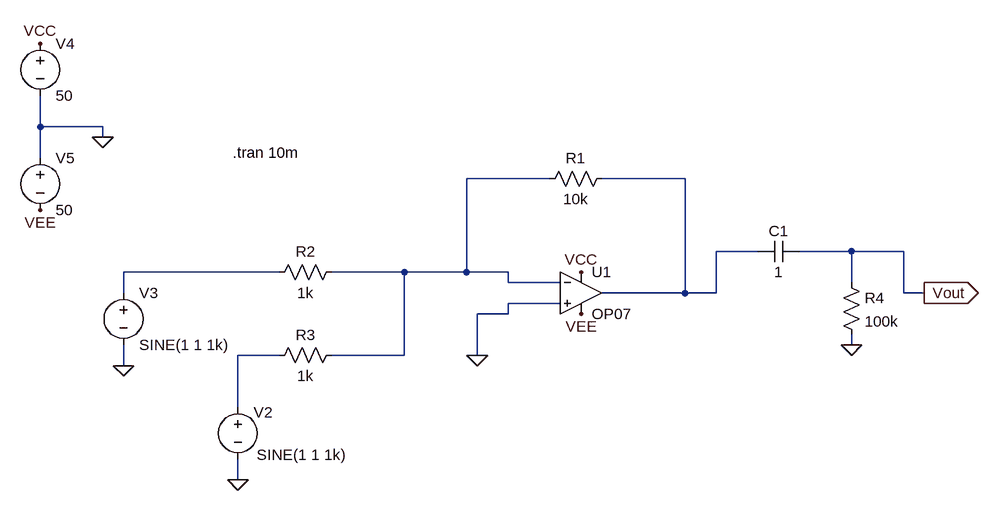
[diagram p0: schematic IdealOPamp_adder.asc]
IdealOPamp_adder.asc, the LTspice schematic file:
Version 4
SHEET 1 1188 680
WIRE -496 -224 -496 -272
WIRE -400 -224 -496 -224
WIRE -400 -208 -400 -224
WIRE -496 -176 -496 -224
WIRE 288 -144 160 -144
WIRE 496 -144 368 -144
WIRE 608 -32 544 -32
WIRE 752 -32 672 -32
WIRE 832 -32 752 -32
WIRE -128 0 -368 0
WIRE 64 0 -48 0
WIRE 160 0 160 -144
WIRE 160 0 64 0
WIRE 224 0 160 0
WIRE 224 16 224 0
WIRE 304 16 224 16
WIRE 752 16 752 -32
WIRE -368 32 -368 0
WIRE 496 32 496 -144
WIRE 496 32 368 32
WIRE 544 32 544 -32
WIRE 544 32 496 32
WIRE 832 32 832 -32
WIRE 864 32 832 32
WIRE 304 48 224 48
WIRE 224 64 224 48
WIRE 224 64 176 64
WIRE 752 112 752 96
WIRE -128 128 -192 128
WIRE 64 128 64 0
WIRE 64 128 -48 128
WIRE 176 128 176 64
WIRE -368 144 -368 112
WIRE -192 208 -192 128
WIRE -192 320 -192 288
FLAG 864 32 Vout
IOPIN 864 32 Out
FLAG -400 -208 0
FLAG -496 -352 VCC
FLAG 336 0 VCC
FLAG -496 -96 VEE
FLAG 336 64 VEE
FLAG -368 144 0
FLAG -192 320 0
FLAG 176 128 0
FLAG 752 112 0
SYMBOL res 384 -160 R90
WINDOW 0 0 56 VBottom 2
WINDOW 3 32 56 VTop 2
SYMATTR InstName R1
SYMATTR Value 10k
SYMBOL res -32 -16 R90
WINDOW 0 0 56 VBottom 2
WINDOW 3 32 56 VTop 2
SYMATTR InstName R2
SYMATTR Value 1k
SYMBOL res -32 112 R90
WINDOW 0 0 56 VBottom 2
WINDOW 3 32 56 VTop 2
SYMATTR InstName R3
SYMATTR Value 1k
SYMBOL voltage -192 192 R0
WINDOW 0 24 24 Left 2
WINDOW 3 29 89 Left 2
WINDOW 123 0 0 Left 0
WINDOW 39 0 0 Left 0
SYMATTR InstName V2
SYMATTR Value SINE(1 1 1k)
SYMBOL voltage -368 16 R0
WINDOW 123 0 0 Left 0
WINDOW 39 0 0 Left 0
SYMATTR InstName V3
SYMATTR Value SINE(1 1 1k)
SYMBOL Opamps\\OP07 336 -32 R0
SYMATTR InstName U1
SYMBOL voltage -496 -368 R0
WINDOW 123 0 0 Left 0
WINDOW 39 0 0 Left 0
SYMATTR InstName V4
SYMATTR Value 50
SYMBOL voltage -496 -192 R0
WINDOW 123 0 0 Left 0
WINDOW 39 0 0 Left 0
SYMATTR InstName V5
SYMATTR Value 50
SYMBOL cap 672 -48 R90
WINDOW 0 0 32 VBottom 2
WINDOW 3 32 32 VTop 2
SYMATTR InstName C1
SYMATTR Value 1
SYMBOL res 736 0 R0
SYMATTR InstName R4
SYMATTR Value 100k
TEXT -200 -184 Left 2 !.tran 10m

The netlist it stands for:
* IdealOPamp_adder.asc
R1 N002 N001 10k
R2 N001 N003 1k
R3 N001 N004 1k
V2 N004 0 SINE(1 1 1k)
V3 N003 0 SINE(1 1 1k)
XU1 0 N001 VCC VEE N002 LT1001  ; OP07, pins In+ In- V+ V- OUT
V4 VCC 0 50
V5 0 VEE 50
C1 Vout N002 1
R4 Vout 0 100k
.tran 10m
.lib LTC.lib
.backanno
.end